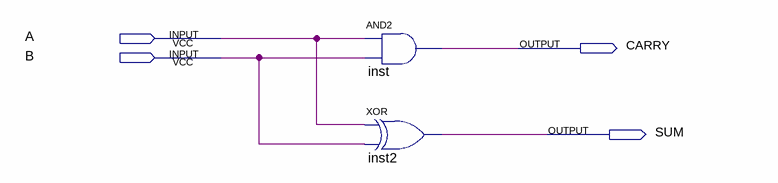
[diagram p0: schematic sheet]
// Quartus schematic week3.bdf as structural Verilog: 2 symbols, 4 pins
module week3 (
  input  A,
  input  B,
  output CARRY,
  output SUM
);

  and inst (CARRY, A, B);
  xor inst2 (SUM, A, B);
endmodule
